# Altium schematic sheet Servo and Encoders.SchDoc: Science - 6_Servo_and_Encoders
size Letter; DrawnBy: Wolfgang Windholtz; Organization: UW Robotics; Address1: 200 University Avenue; Address2: Waterloo; Address3: Ontario; Address4: Canada N2L 3G6; SheetNumber: 6; SheetTotal: 6
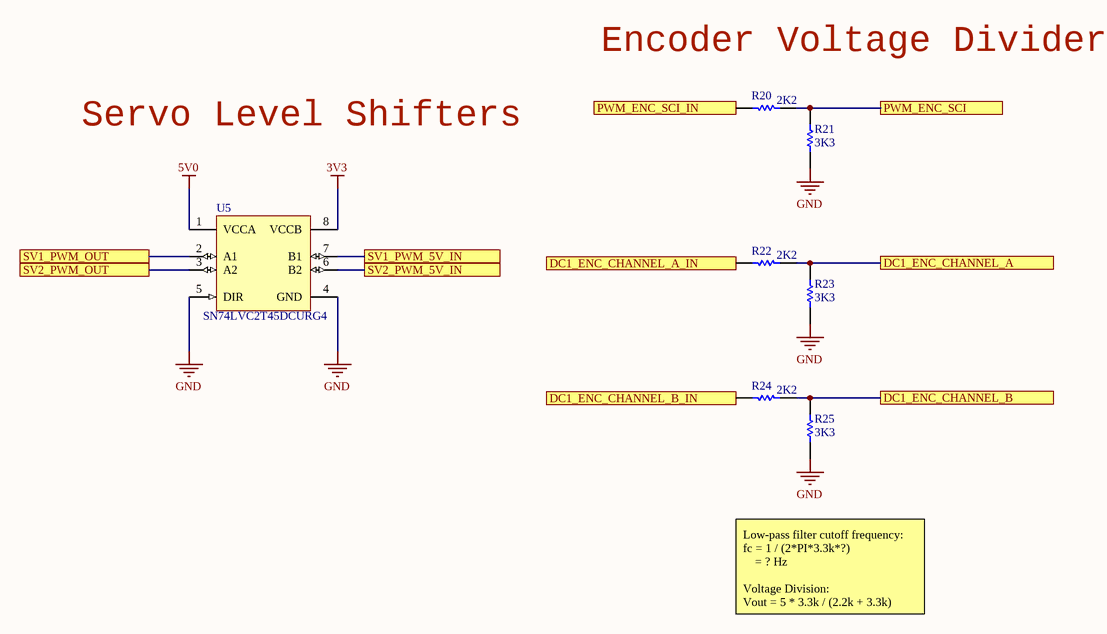
[diagram p0: Servo and Encoders.SchDoc]

## Parts
R20  value 2K2  [RESC0603(1608)_N]  (hidden comment: RES_2K2_0603)
R21  value 3K3  [RESC0603(1608)_N]  (hidden comment: RES_3K3_0603)
R22  value 2K2  [RESC0603(1608)_N]  (hidden comment: RES_2K2_0603)
R23  value 3K3  [RESC0603(1608)_N]  (hidden comment: RES_3K3_0603)
R24  value 2K2  [RESC0603(1608)_N]  (hidden comment: RES_2K2_0603)
R25  value 3K3  [RESC0603(1608)_N]  (hidden comment: RES_3K3_0603)
U5  SN74LVC2T45DCURG4  [DCU0008A_L]

## Ports
DC1_ENC_CHANNEL_A, DC1_ENC_CHANNEL_A_IN, DC1_ENC_CHANNEL_B, DC1_ENC_CHANNEL_B_IN, PWM_ENC_SCI, PWM_ENC_SCI_IN, SV1_PWM_5V_IN, SV1_PWM_OUT, SV2_PWM_5V_IN, SV2_PWM_OUT

## Nets
3V3: U5.8(VCCB)
5V0: U5.1(VCCA)
GND: R21.1 R23.1 R25.1 U5.4(GND) U5.5(DIR)
DC1_ENC_CHANNEL_A: R22.1 R23.2 ; port DC1_ENC_CHANNEL_A
DC1_ENC_CHANNEL_A_IN: R22.2 ; port DC1_ENC_CHANNEL_A_IN
DC1_ENC_CHANNEL_B: R24.1 R25.2 ; port DC1_ENC_CHANNEL_B
DC1_ENC_CHANNEL_B_IN: R24.2 ; port DC1_ENC_CHANNEL_B_IN
PWM_ENC_SCI: R20.1 R21.2 ; port PWM_ENC_SCI
PWM_ENC_SCI_IN: R20.2 ; port PWM_ENC_SCI_IN
SV1_PWM_5V_IN: U5.7(B1) ; port SV1_PWM_5V_IN
SV1_PWM_OUT: U5.2(A1) ; port SV1_PWM_OUT
SV2_PWM_5V_IN: U5.6(B2) ; port SV2_PWM_5V_IN
SV2_PWM_OUT: U5.3(A2) ; port SV2_PWM_OUT

## Notes on the sheet
- Encoder Voltage Dividers
- Servo Level Shifters
- Low-pass filter cutoff frequency:
  fc = 1 / (2*PI*3.3k*?)
  = ? Hz
  Voltage Division:
  Vout = 5 * 3.3k / (2.2k + 3.3k)
  = 3 V
- Title
- Size:
- Date:
- Letter
- Drawn By:
- Sheet
- of
- File:

## Library data of the parts
R20 R22 R24 = RES_2K2_0603: RES SMD 2.2K OHM 1% 1/10W 0603; Manufacturer: Yageo; MPN: RC0603FR-072K2L; Dimensions: 0.063" L x 0.031" W (1.60mm x 0.80mm); Package: 0603 (1608 Metric); Tolerance: 1%; Supplier 1: Digi-Key; Supplier Part Number 1: 311-2.20KHRCT-ND
R21 R23 R25 = RES_3K3_0603: RES SMD 3.3K OHM 5% 1/10W 0603; Manufacturer: Yageo; MPN: RC0603JR-073K3L; Dimensions: 0.063" L x 0.031" W (1.60mm x 0.80mm); Package: 0603 (1608 Metric); Tolerance: 5%; Supplier Part Number 1: 311-3.3KGRCT-ND; Supplier 1: Digi-Key; Digikey Part Number: 311-3.3KGRCT-ND
U5 = IC_LVL_SHIFTER: IC BIDIRECTIONAL LEVEL SHIFTER 8-VSSOP; Manufacturer 1: Texas Instruments; tpd @ Nom Voltage(Max)(ns): 17.7,10.3,8.3,7.2; Logic: True; Rating: Military; ICC @ Nom Voltage(Max)(mA): 0.004; Bits(#): 2; 3-State Output: Yes; Schmitt Trigger: No; Technology Family: LVC; Sub-Family: Dual Supply Translator; Output Drive (IOL/IOH)(Max)(mA): 32/-32; Output Type: CMOS; VCC(Max)(V): 5.5; Input Type: CMOS/TTL; F @ Nom Voltage(Max)(Mhz): 150; VCC(Min)(V): 1.65; Voltage(Nom)(V): 1.8,2.5,3.3,5; PackageReference: DCU0008A; Generic Part Number: SN74LVC2T45; DatasheetVersion: SCES516J; Operating Temperature Range(C): -40 to 85; Supplier 1: Digi-Key; Supplier Part Number 1: 296-39213-2-ND; Manufacturer Part Number 1: SN74LVC2T45DCURG4; Mount: Surface Mount